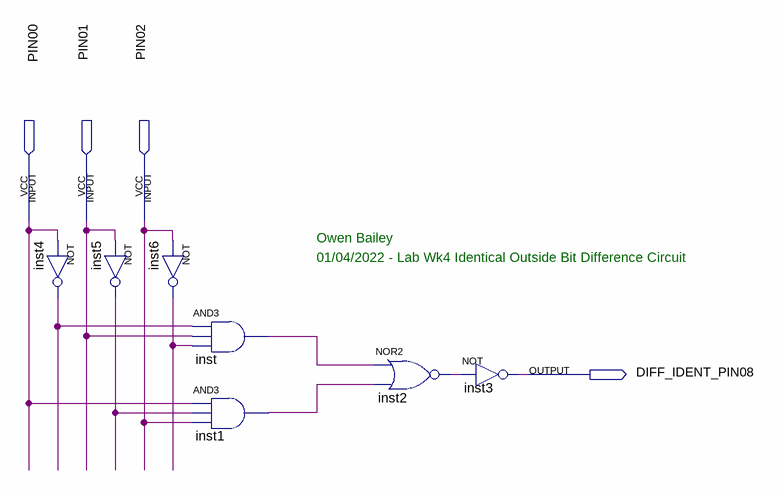
[diagram p0: schematic sheet]
// Quartus schematic identicaloutsidexor.bdf as structural Verilog: 7 symbols, 4 pins
module identicaloutsidexor (
  input  PIN00,
  input  PIN01,
  input  PIN02,
  output DIFF_IDENT_PIN08
);

  wire inst1_out, inst2_out, inst4_out, inst5_out, inst6_out, inst_out;

  not inst4 (inst4_out, PIN00);
  not inst5 (inst5_out, PIN01);
  not inst6 (inst6_out, PIN02);
  and inst (inst_out, inst4_out, PIN01, inst6_out);
  and inst1 (inst1_out, PIN00, inst5_out, PIN02);
  nor inst2 (inst2_out, inst_out, inst1_out);
  not inst3 (DIFF_IDENT_PIN08, inst2_out);

  // Notes on the sheet:
  //   Owen Bailey
  //   01/04/2022 - Lab Wk4 Identical Outside Bit Difference Circuit
endmodule
